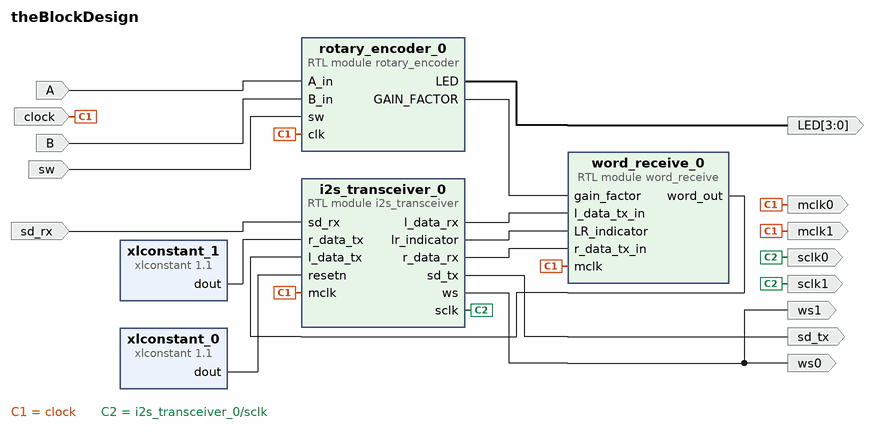
[diagram p0: block diagram of the top level]
# Vivado block design theBlockDesign, xc7s25csga225-1, Vivado 2021.2
create_bd_design theBlockDesign

create_bd_port -dir I -type clk clock
set_property -dict {CONFIG.FREQ_HZ 12000000} [get_bd_ports clock]
create_bd_port -dir O mclk0
create_bd_port -dir O mclk1
create_bd_port -dir O sclk0
create_bd_port -dir O sclk1
create_bd_port -dir I sd_rx
create_bd_port -dir O sd_tx
create_bd_port -dir O ws0
create_bd_port -dir O ws1
create_bd_port -dir I sw
create_bd_port -dir I A
create_bd_port -dir I B
create_bd_port -dir O -from 3 -to 0 LED

create_bd_cell -type ip -vlnv xilinx.com:ip:xlconstant:1.1 xlconstant_0
create_bd_cell -type module -reference i2s_transceiver i2s_transceiver_0
create_bd_cell -type module -reference rotary_encoder rotary_encoder_0
create_bd_cell -type ip -vlnv xilinx.com:ip:xlconstant:1.1 xlconstant_1
set_property -dict {CONFIG.CONST_VAL 0 CONFIG.CONST_WIDTH 24} [get_bd_cells xlconstant_1]
create_bd_cell -type module -reference word_receive word_receive_0

# ---- connections ----

connect_bd_net [get_bd_ports A] [get_bd_pins rotary_encoder_0/A_in]
connect_bd_net [get_bd_ports B] [get_bd_pins rotary_encoder_0/B_in]
connect_bd_net [get_bd_ports clock] \
  [get_bd_pins rotary_encoder_0/clk] [get_bd_ports mclk0] [get_bd_ports mclk1] [get_bd_pins i2s_transceiver_0/mclk] \
  [get_bd_pins word_receive_0/mclk]
connect_bd_net [get_bd_pins i2s_transceiver_0/l_data_rx] [get_bd_pins word_receive_0/l_data_tx_in]
connect_bd_net [get_bd_pins i2s_transceiver_0/lr_indicator] [get_bd_pins word_receive_0/LR_indicator]
connect_bd_net [get_bd_pins i2s_transceiver_0/r_data_rx] [get_bd_pins word_receive_0/r_data_tx_in]
connect_bd_net [get_bd_pins i2s_transceiver_0/sclk] [get_bd_ports sclk0] [get_bd_ports sclk1]
connect_bd_net [get_bd_pins i2s_transceiver_0/sd_tx] [get_bd_ports sd_tx]
connect_bd_net [get_bd_pins i2s_transceiver_0/ws] [get_bd_ports ws0] [get_bd_ports ws1]
connect_bd_net [get_bd_pins rotary_encoder_0/GAIN_FACTOR] [get_bd_pins word_receive_0/gain_factor]
connect_bd_net [get_bd_pins rotary_encoder_0/LED] [get_bd_ports LED]
connect_bd_net [get_bd_ports sd_rx] [get_bd_pins i2s_transceiver_0/sd_rx]
connect_bd_net [get_bd_ports sw] [get_bd_pins rotary_encoder_0/sw]
connect_bd_net -net word_receive_0_l_data_tx_out [get_bd_pins word_receive_0/word_out] [get_bd_pins i2s_transceiver_0/l_data_tx]
connect_bd_net -net word_receive_0_r_data_tx_out [get_bd_pins xlconstant_1/dout] [get_bd_pins i2s_transceiver_0/r_data_tx]
connect_bd_net [get_bd_pins xlconstant_0/dout] [get_bd_pins i2s_transceiver_0/resetn]

validate_bd_design
save_bd_design
